# EasyEDA schematic 1-Schematic_buffered_multiple.json
TITLE: buffered multiple; REV: 1.0; Date: 2025-03-12; Sheet: 1/1; Drawn By: Tilman; Company: TekNoiseLab
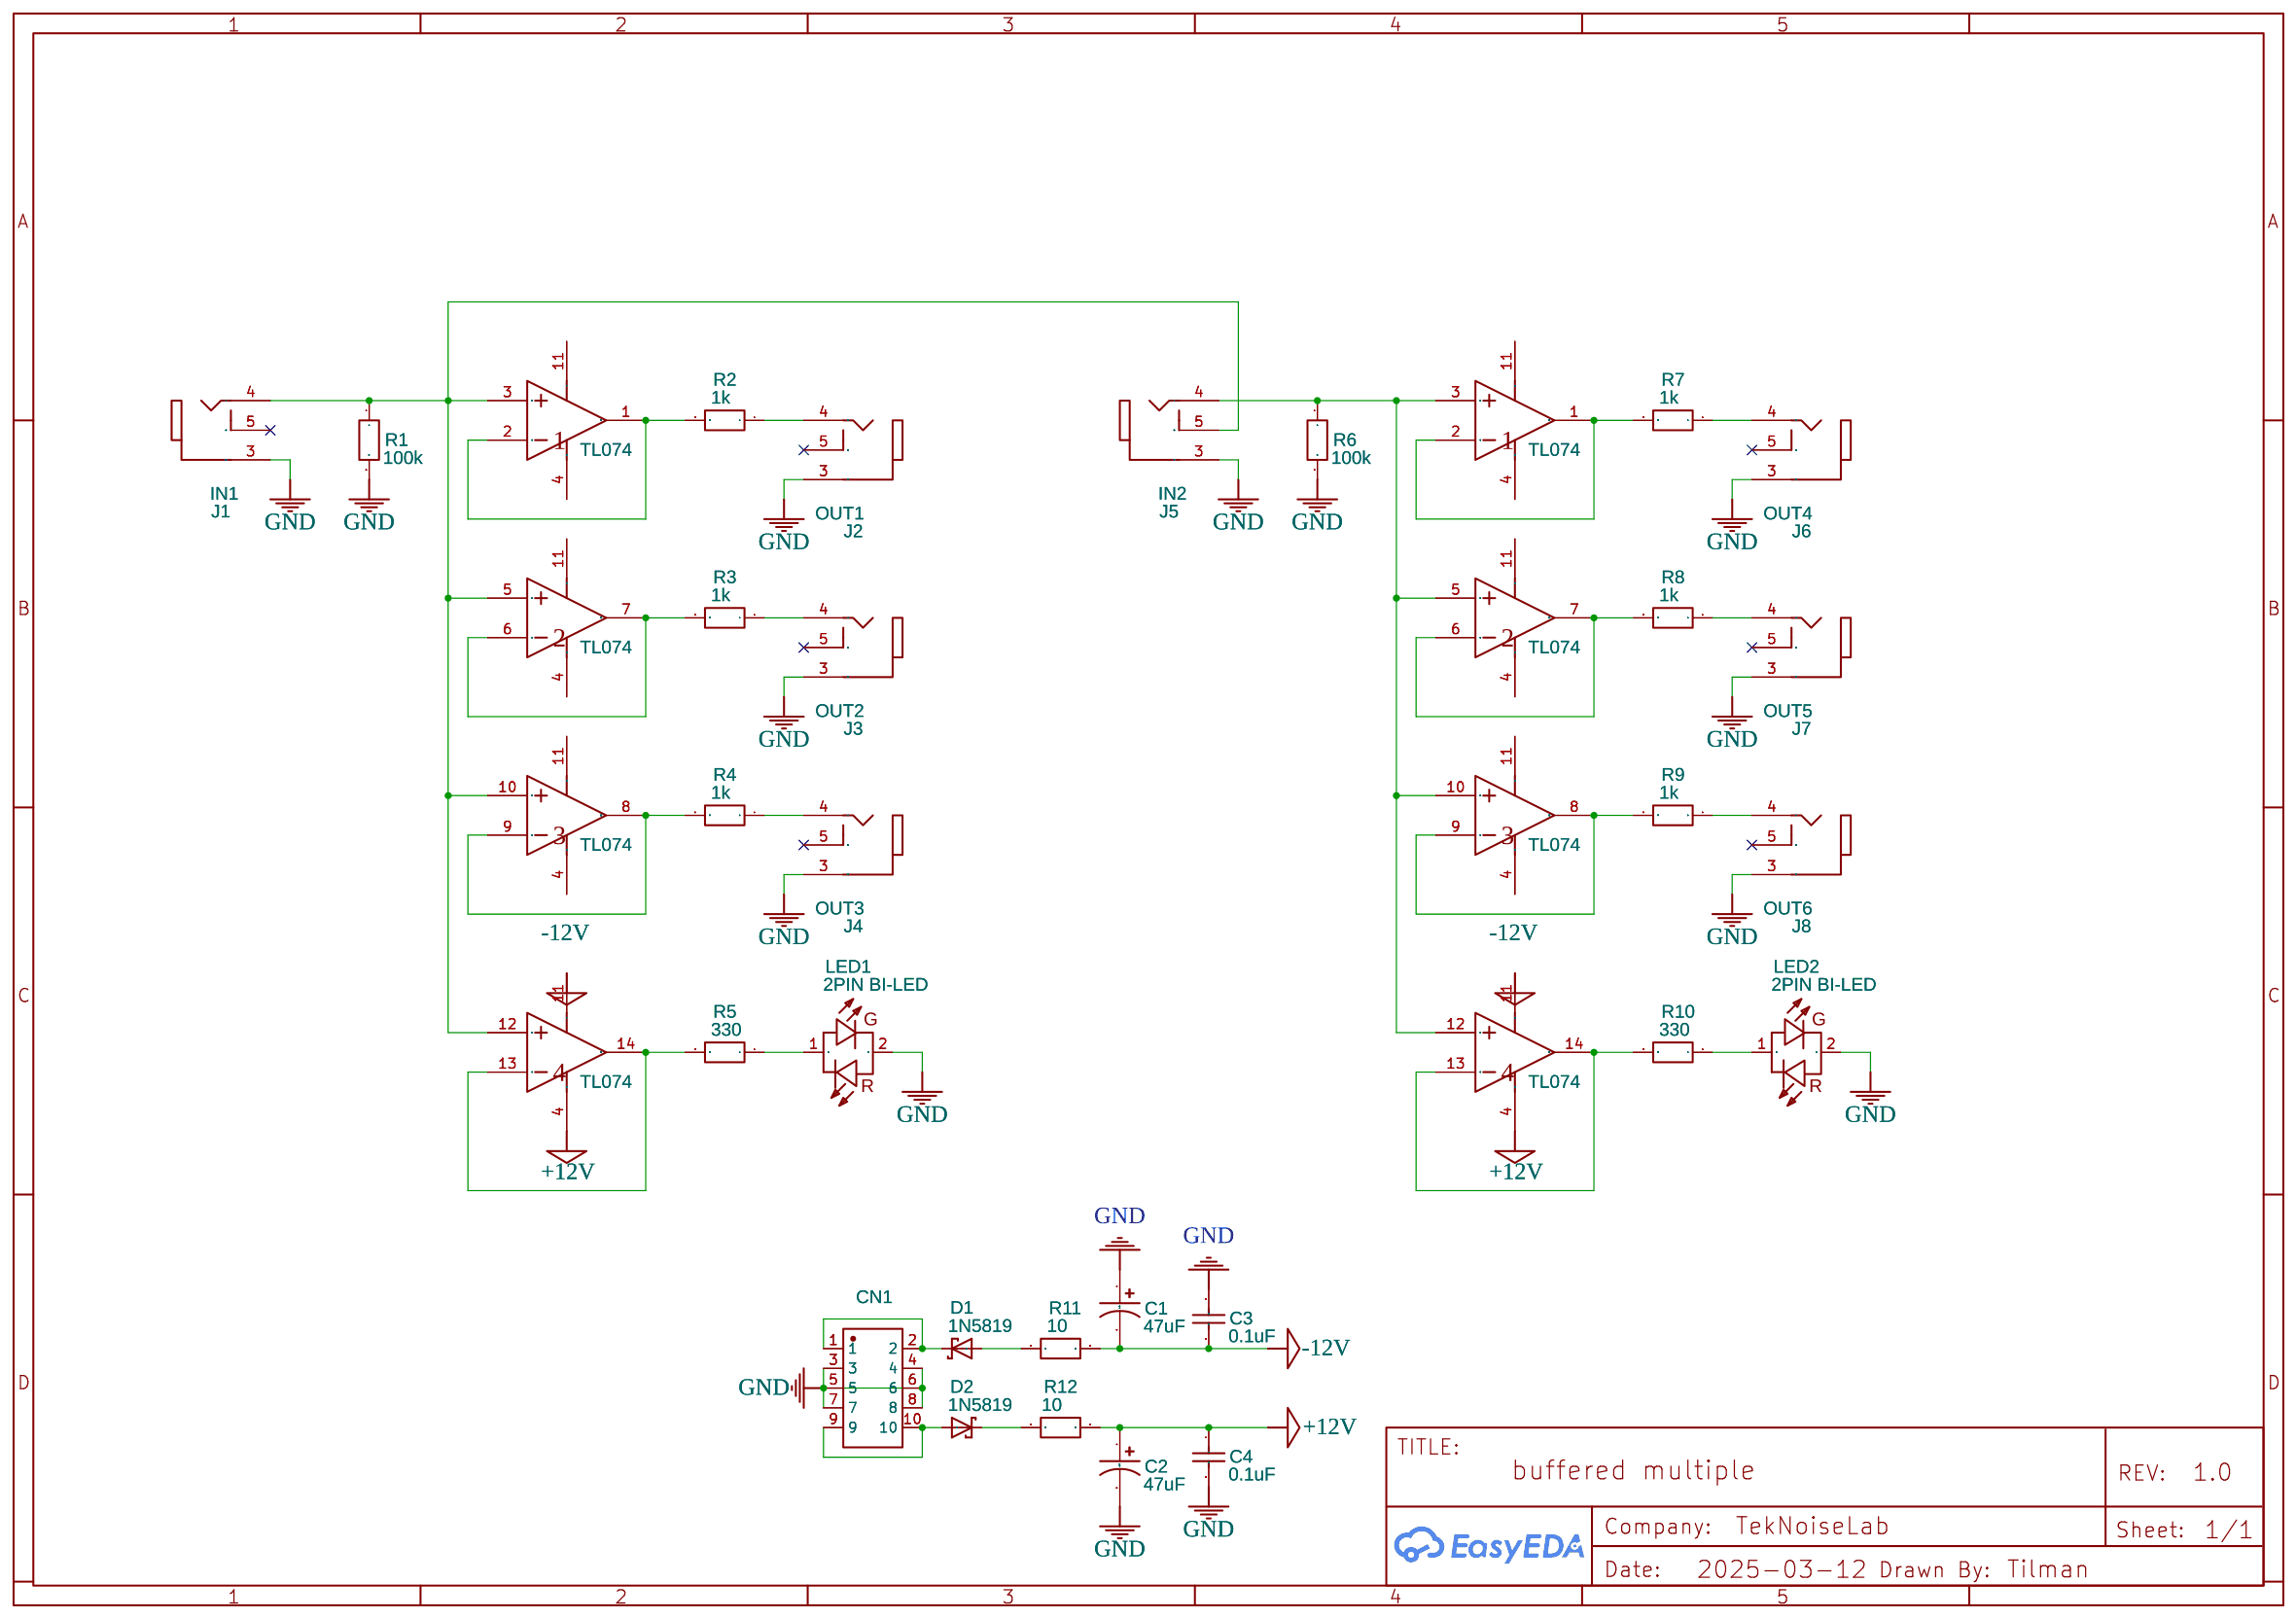
[diagram p0: schematic sheet]

## Parts
C1  47uF  [CAP-TH_BD5.0-P2.00-D0.5-FD]
C2  47uF  [CAP-TH_BD5.0-P2.00-D0.5-FD]
C3  0.1uF  [CAP-2.5*6.5*7.2]
C4  0.1uF  [CAP-2.5*6.5*7.2]
CN1  DC3-2.54-10PAS  [CONN-TH_10P-P2.54_DC3-2.54-10PAS]
D1  1N5819  [DO41-7.6]
D2  1N5819  [DO41-7.6]
J1  IN1  [PJM323 TAYDA A-2557]
J2  OUT1  [PJM323 TAYDA A-2557]
J3  OUT2  [PJM323 TAYDA A-2557]
J4  OUT3  [PJM323 TAYDA A-2557]
J5  IN2  [PJM323 TAYDA A-2557]
J6  OUT4  [PJM323 TAYDA A-2557]
J7  OUT5  [PJM323 TAYDA A-2557]
J8  OUT6  [PJM323 TAYDA A-2557]
LED1  2PIN BI-LED  [2 PIN BI-LED GREEN RED 3MM]
LED2  2PIN BI-LED  [2 PIN BI-LED GREEN RED 3MM]
R1  100k  [RES-TH_BD2.4-L6.3-P10.30-D0.6]
R2  1k  [RES-TH_BD2.4-L6.3-P10.30-D0.6]
R3  1k  [RES-TH_BD2.4-L6.3-P10.30-D0.6]
R4  1k  [RES-TH_BD2.4-L6.3-P10.30-D0.6]
R5  330  [RES-TH_BD2.4-L6.3-P10.30-D0.6]
R6  100k  [RES-TH_BD2.4-L6.3-P10.30-D0.6]
R7  1k  [RES-TH_BD2.4-L6.3-P10.30-D0.6]
R8  1k  [RES-TH_BD2.4-L6.3-P10.30-D0.6]
R9  1k  [RES-TH_BD2.4-L6.3-P10.30-D0.6]
R10  330  [RES-TH_BD2.4-L6.3-P10.30-D0.6]
R11  10  [RES-TH_BD2.4-L6.3-P10.30-D0.6]
R12  10  [RES-TH_BD2.4-L6.3-P10.30-D0.6]
U1  TL074  [DIP14]  (sections 1,2,3,4)
U2  TL074  [DIP14]  (sections 1,2,3,4)

## Library data of the parts
C1 C2 = 50MS710MEFCTZ5X7: Contributor: lcsc; Supplier: LCSC; Supplier Part: C5115261; Manufacturer: rubycon(红宝石)
C3 C4 = 0.22uF 5% 100VCalibration capacitor: Supplier Part: undefined; Supplier: LCSC; Manufacturer: ReliaPro
CN1 = DC3-2.54-10PAS: Contributor: lcsc; Supplier: LCSC; Supplier Part: C2977596; Manufacturer: ZHOURI(洲日); JLCPCB Part Class: Extended Part
D1 D2 = 1N5819-B: 1.0A SCHOTTKY BARRIER RECTIFIER
J1-J8 = PJ323M Tayda: Supplier: Tayda; Supplier Part: A-2557; Contributor: flounderguts
LED1 LED2 = 2PIN BI-LED GREEN RED: Manufacturer: Multicomp Pro; Manufacturer Part: MCL036YGW; Supplier: Element14; Supplier Part: MCL036YGW; link: https://uk.farnell.com/multicomp/mcl036ygw/led-3mm-ac-yellow-grn/dp/1581206?ICID=I-RP-STM7REC-0; Contributor: APISOFT Thailand; DataSheet: https://www.farnell.com/datasheets/2861574.pdf
R1-R12 = Res_AXIAL-0.4(1/4W)_US
U1 U2 = TL074BCN: Low-Noise JFET-Input Operational Amplifier; subpart_no: 1

## Nets
+12V: C2.1 C4.1 R12.1 U1.4(V+) U2.4(V+)
-12V: C1.2 C3.2 R11.2 U1.11(V-) U2.11(V-)
GND: C1.1 C2.2 C3.1 C4.2 CN1.3 CN1.4 CN1.5 CN1.6 CN1.7 CN1.8 J1.3 J2.3 J3.3 J4.3 J5.3 J6.3 J7.3 J8.3 LED1.2 LED2.2 R1.2 R6.2
Net-(CN1-1): CN1.1 CN1.2 D1.C
Net-(CN1-9): CN1.9 CN1.10 D2.A
Net-(D1-A): D1.A R11.1
Net-(D2-C): D2.C R12.2
Net-(J1-4): J1.4 J5.5 R1.1 U1.3(IN+) U1.5(IN+) U1.10(IN+) U1.12(IN+)
Net-(J2-4): J2.4 R2.1
Net-(J3-4): J3.4 R3.1
Net-(J4-4): J4.4 R4.1
Net-(J5-4): J5.4 R6.1 U2.3(IN+) U2.5(IN+) U2.10(IN+) U2.12(IN+)
Net-(J6-4): J6.4 R7.1
Net-(J7-4): J7.4 R8.1
Net-(J8-4): J8.4 R9.1
Net-(LED1-1): LED1.1 R5.1
Net-(LED2-1): LED2.1 R10.1
Net-(R2-2): R2.2 U1.1(OUT) U1.2(IN-)
Net-(R3-2): R3.2 U1.6(IN-) U1.7(OUT)
Net-(R4-2): R4.2 U1.8(OUT) U1.9(IN-)
Net-(R5-2): R5.2 U1.13(IN-) U1.14(OUT)
Net-(R7-2): R7.2 U2.1(OUT) U2.2(IN-)
Net-(R8-2): R8.2 U2.6(IN-) U2.7(OUT)
Net-(R9-2): R9.2 U2.8(OUT) U2.9(IN-)
Net-(R10-2): R10.2 U2.13(IN-) U2.14(OUT)

Not connected (* = marked no-connect by the designer): J1 5*; J2 5*; J3 5*; J4 5*; J6 5*; J7 5*; J8 5*
